# Altium schematic sheet Sheet2.SchDoc
size A
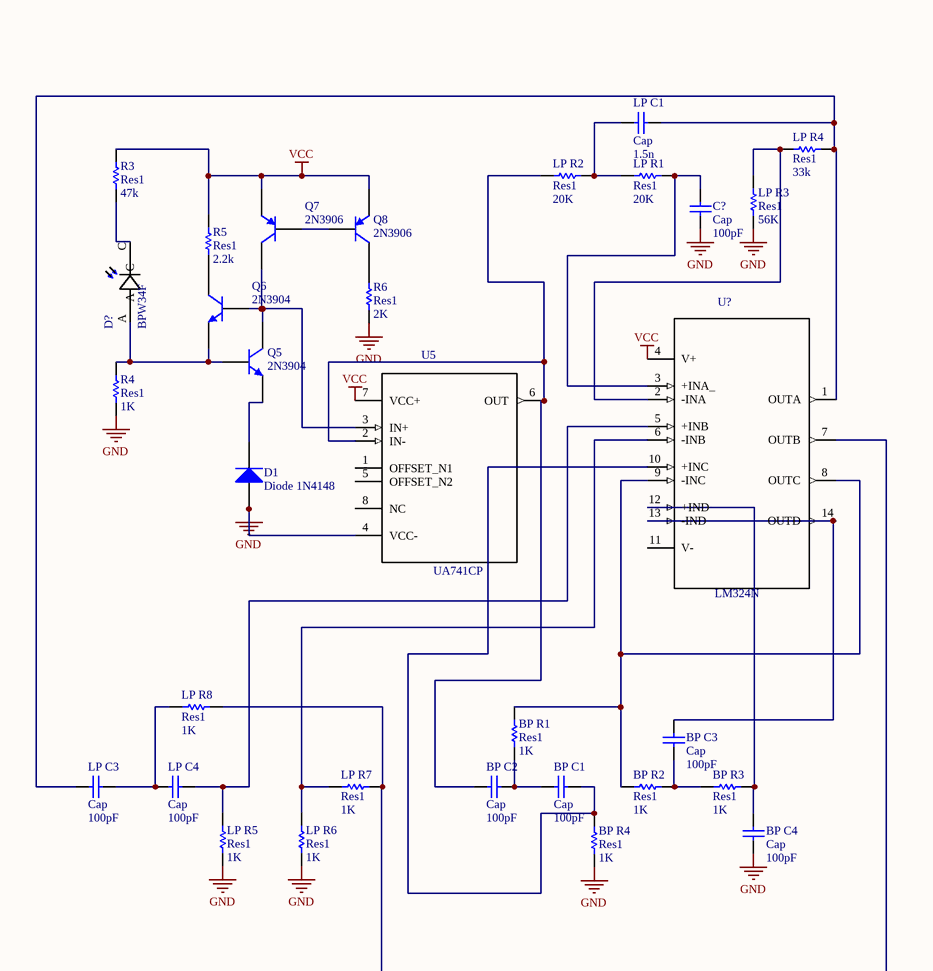
[diagram p0: Sheet2.SchDoc, bottom left]

## Parts
BP_C1  Cap  value 100pF  [RAD-0.3]
BP_C2  Cap  value 100pF  [RAD-0.3]
BP_C3  Cap  value 100pF  [RAD-0.3]
BP_C4  Cap  value 100pF  [RAD-0.3]
BP_R1  Res1  value 1K  [AXIAL-0.3]
BP_R2  Res1  value 1K  [AXIAL-0.3]
BP_R3  Res1  value 1K  [AXIAL-0.3]
BP_R4  Res1  value 1K  [AXIAL-0.3]
C?  Cap  value 100pF  [RAD-0.3]
D1  Diode 1N4148  [DO-35]
D?  BPW34F  [*PHODET_BPW34F_BPW34F(Primary)]
LP_C1  Cap  value 1.5n  [RAD-0.3]
LP_C3  Cap  value 100pF  [RAD-0.3]
LP_C4  Cap  value 100pF  [RAD-0.3]
LP_R1  Res1  value 20K  [AXIAL-0.3]
LP_R2  Res1  value 20K  [AXIAL-0.3]
LP_R3  Res1  value 56K  [AXIAL-0.3]
LP_R4  Res1  value 33k  [AXIAL-0.3]
LP_R5  Res1  value 1K  [AXIAL-0.3]
LP_R6  Res1  value 1K  [AXIAL-0.3]
LP_R7  Res1  value 1K  [AXIAL-0.3]
LP_R8  Res1  value 1K  [AXIAL-0.3]
Q5  2N3904  [TO-92A]
Q6  2N3904  [TO-92A]
Q7  2N3906  [TO-92A]
Q8  2N3906  [TO-92A]
R3  Res1  value 47k  [AXIAL-0.3]
R4  Res1  value 1K  [AXIAL-0.3]
R5  Res1  value 2.2k  [AXIAL-0.3]
R6  Res1  value 2K  [AXIAL-0.3]
U5  UA741CP  [*DIP254P762X508-8]
U?  LM324N  [*DIP254P762X508-14]

## Nets
GND: BP_C4.1 BP_R4.1 C?.1 D1.1(A) LP_R3.1 LP_R5.1 LP_R6.1 R4.1 R6.1 U5.4(VCC-)
VCC: Q7.1(E) Q8.1(E) R3.2 R5.2 U5.7(VCC+) U?.4(V+)
NetBP_C1_1: BP_C1.1 BP_C2.2 BP_R1.1
NetBP_C1_2: BP_C1.2 BP_R4.2 U?.10(+INC)
NetBP_C2_1: BP_C2.1 LP_R2.2 U5.2(IN-) U5.6(OUT)
NetBP_C3_1: BP_C3.1 BP_R2.2 BP_R3.1
NetBP_C3_2: BP_C3.2 U?.13(-IND) U?.14(OUTD)
NetBP_C4_2: BP_C4.2 BP_R3.2 U?.12(+IND)
NetBP_R1_2: BP_R1.2 BP_R2.1 U?.8(OUTC) U?.9(-INC)
NetC?_2: C?.2 LP_R1.1 U?.3(+INA_)
NetD1_2: D1.2(K) Q5.1(E)
NetD?_A: D?.A Q5.2(B) Q6.1(E) R4.2
NetD?_C: D?.C R3.1
NetLP_C1_1: LP_C1.1 LP_C3.1 LP_R4.1 U?.1(OUTA)
NetLP_C1_2: LP_C1.2 LP_R1.2 LP_R2.1
NetLP_C3_2: LP_C3.2 LP_C4.1 LP_R8.1
NetLP_C4_2: LP_C4.2 LP_R5.2 U?.5(+INB)
NetLP_R3_2: LP_R3.2 LP_R4.2 U?.2(-INA)
NetLP_R6_2: LP_R6.2 LP_R7.1 U?.6(-INB)
NetLP_R7_2: LP_R7.2 LP_R8.2 U?.7(OUTB)
NetQ5_3: Q5.3(C) Q6.2(B) Q7.3(C) U5.3(IN+)
NetQ6_3: Q6.3(C) R5.1
NetQ7_2: Q7.2(B) Q8.2(B)
NetQ8_3: Q8.3(C) R6.2

Not connected (* = marked no-connect by the designer): U5 1(OFFSET_N1) 5(OFFSET_N2) 8(NC); U? 11(V-)

## Library data of the parts
BP_C1-BP_C4 C? LP_C1 LP_C3 LP_C4 = Cap: Capacitor; Published: 8-Jun-2000; LatestRevisionDate: 17-Jul-2002; LatestRevisionNote: Re-released for DXP Platform.; PackageReference: RAD-0.3; Publisher: Altium Limited; PackageDescription: Radial Cap, Thru-Hole; 2 Leads; 0.3 in Pin Spacing
BP_R1-BP_R4 LP_R1-LP_R8 R3-R6 = Res1: Resistor; Published: 8-Jun-2000; LatestRevisionDate: 17-Jul-2002; LatestRevisionNote: Re-released for DXP Platform.; PackageReference: AXIAL-0.3; Publisher: Altium Limited; PackageDescription: Axial Device, Thru-Hole; 2 Leads; 0.3 in Pin Spacing
D1 = Diode 1N4148: High Conductance Fast Diode; Published: 8-Jun-2000; LatestRevisionDate: 17-Jul-2002; LatestRevisionNote: Re-released for DXP Platform.; DatasheetVersion: 1997; PackageReference: DO-35; Publisher: Altium Limited; PackageDescription: Diode, Axial; Body 3.8 x 1.9 mm (LxDia. max), Lead Dia. 0.53 mm (max); Code_JEDEC: DO-204-AH; ComponentLink1Description: Manufacturer Link; ComponentLink1URL: http://www.fairchildsemi.com/; ComponentLink2Description: Datasheet; ComponentLink2URL: http://www.fairchildsemi.com/ds/1N%2F1N4148.pdf
D? = BPW34F: Photodiode PIN Chip 950nm 0.59A/W Sensitivity Automotive 2-Pin PDIL; MF: OSRAM Opto; Price: None; Package: DIP-2 OSRAM; MP: BPW34F; SnapEDA_Link: https://www.snapeda.com/parts/BPW34F/OSRAM%20Opto%20Semiconductors%20Inc./view-part/?ref=snap; Availability: Unavailable; Value: *
Q5 Q6 = 2N3904: NPN General Purpose Amplifier; Published: 8-Jun-2000; LatestRevisionDate: 15-Jan-2003; LatestRevisionNote: PCB Footprint 'BCY-W3/D4.7' replaced; DatasheetVersion: 1997; PackageVersion: Sep-1998; PackageReference: TO-92A; Publisher: Altium Limited; PackageDescription: TO, Flat Index; 3 In-Line, Axial Leads; Body Dia. 4.5mm; Leads 0.51 x 0.48 mm (max); ComponentLink1Description: Manufacturer Link; ComponentLink1URL: http://www.fairchildsemi.com/; ComponentLink2Description: Datasheet; ComponentLink2URL: http://www.fairchildsemi.com/ds/2N%2F2N3904.pdf
Q7 Q8 = 2N3906: PNP General Purpose Amplifier; Published: 8-Jun-2000; LatestRevisionDate: 15-Jan-2003; LatestRevisionNote: PCB Footprint 'BCY-W3/D4.7' replaced; DatasheetVersion: 1997; PackageVersion: Sep-1998; PackageReference: TO-92A; Publisher: Altium Limited; PackageDescription: TO, Flat Index; 3 In-Line, Axial Leads; Body Dia. 4.5mm; Leads 0.51 x 0.48 mm (max); ComponentLink1Description: Manufacturer Link; ComponentLink1URL: http://www.fairchildsemi.com/; ComponentLink2Description: Datasheet; ComponentLink2URL: http://www.fairchildsemi.com/ds/2N%2F2N3906.pdf
U5 = UA741CP: / OP Amp Single GP Â±18V 8-Pin PDIP Tube OP Amp Single GP Â±18V 8-Pin PDIP Tube OP Amp Single GP Â±18V 8-Pin PDIP Tube /; MF: Texas Instruments; Price: None; Package: PDIP-8 Texas Instruments; MP: UA741CP; SnapEDA_Link: https://www.snapeda.com/parts/UA741CP/Texas%20Instruments/view-part/?ref=snap; Availability: Unavailable; Value: *
U? = LM324N: Ic Opamp Gp 1.2mhz 14dip; MF: ON Semiconductor; Package: PDIP-14 Motorola; MP: LM324N; Price: None; Availability: Unavailable; SnapEDA_Link: https://www.snapeda.com/parts/LM324N/ON%20Semiconductor/view-part/?ref=snap; Value: *